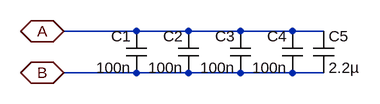
[diagram p0: schematic HF_decoup.asc]
HF_decoup.asc, the LTspice schematic file:
Version 4.1
SHEET 1 880 680
WIRE 192 96 80 96
WIRE 272 96 192 96
WIRE 352 96 272 96
WIRE 432 96 352 96
WIRE 480 96 432 96
WIRE 192 160 80 160
WIRE 272 160 192 160
WIRE 352 160 272 160
WIRE 432 160 352 160
WIRE 480 160 432 160
FLAG 80 96 A
IOPIN 80 96 BiDir
FLAG 80 160 B
IOPIN 80 160 BiDir
SYMBOL cap 208 160 R180
WINDOW 0 24 56 Left 2
WINDOW 3 24 8 Left 2
SYMATTR InstName C1
SYMATTR Value 100n
SYMATTR SpiceLine V=450 Rser=0.0242 Lser=0.75n Rpar=5G
SYMBOL cap 288 160 R180
WINDOW 0 24 56 Left 2
WINDOW 3 24 8 Left 2
SYMATTR InstName C2
SYMATTR Value 100n
SYMATTR SpiceLine V=450 Rser=0.0242 Lser=0.75n Rpar=5G
SYMBOL cap 368 160 R180
WINDOW 0 24 56 Left 2
WINDOW 3 24 8 Left 2
SYMATTR InstName C3
SYMATTR Value 100n
SYMATTR SpiceLine V=450 Rser=0.0242 Lser=0.75n Rpar=5G
SYMBOL cap 448 160 R180
WINDOW 0 24 56 Left 2
WINDOW 3 24 8 Left 2
SYMATTR InstName C4
SYMATTR Value 100n
SYMATTR SpiceLine V=450 Rser=0.0242 Lser=0.75n Rpar=5G
SYMBOL cap 464 96 R0
SYMATTR InstName C5
SYMATTR Value 2.2µ
SYMATTR SpiceLine V=450 Rser=0.0043 Lser=0.65n Rpar=0.227G

The netlist it stands for:
* HF_decoup.asc
C1 B A 100n V=450 Rser=0.0242 Lser=0.75n Rpar=5G
C2 B A 100n V=450 Rser=0.0242 Lser=0.75n Rpar=5G
C3 B A 100n V=450 Rser=0.0242 Lser=0.75n Rpar=5G
C4 B A 100n V=450 Rser=0.0242 Lser=0.75n Rpar=5G
C5 A B 2.2µ V=450 Rser=0.0043 Lser=0.65n Rpar=0.227G
.backanno
.end